# Altium schematic sheet 12V_Efuses1.SchDoc
size A4; SheetNumber: 3; SheetTotal: 5
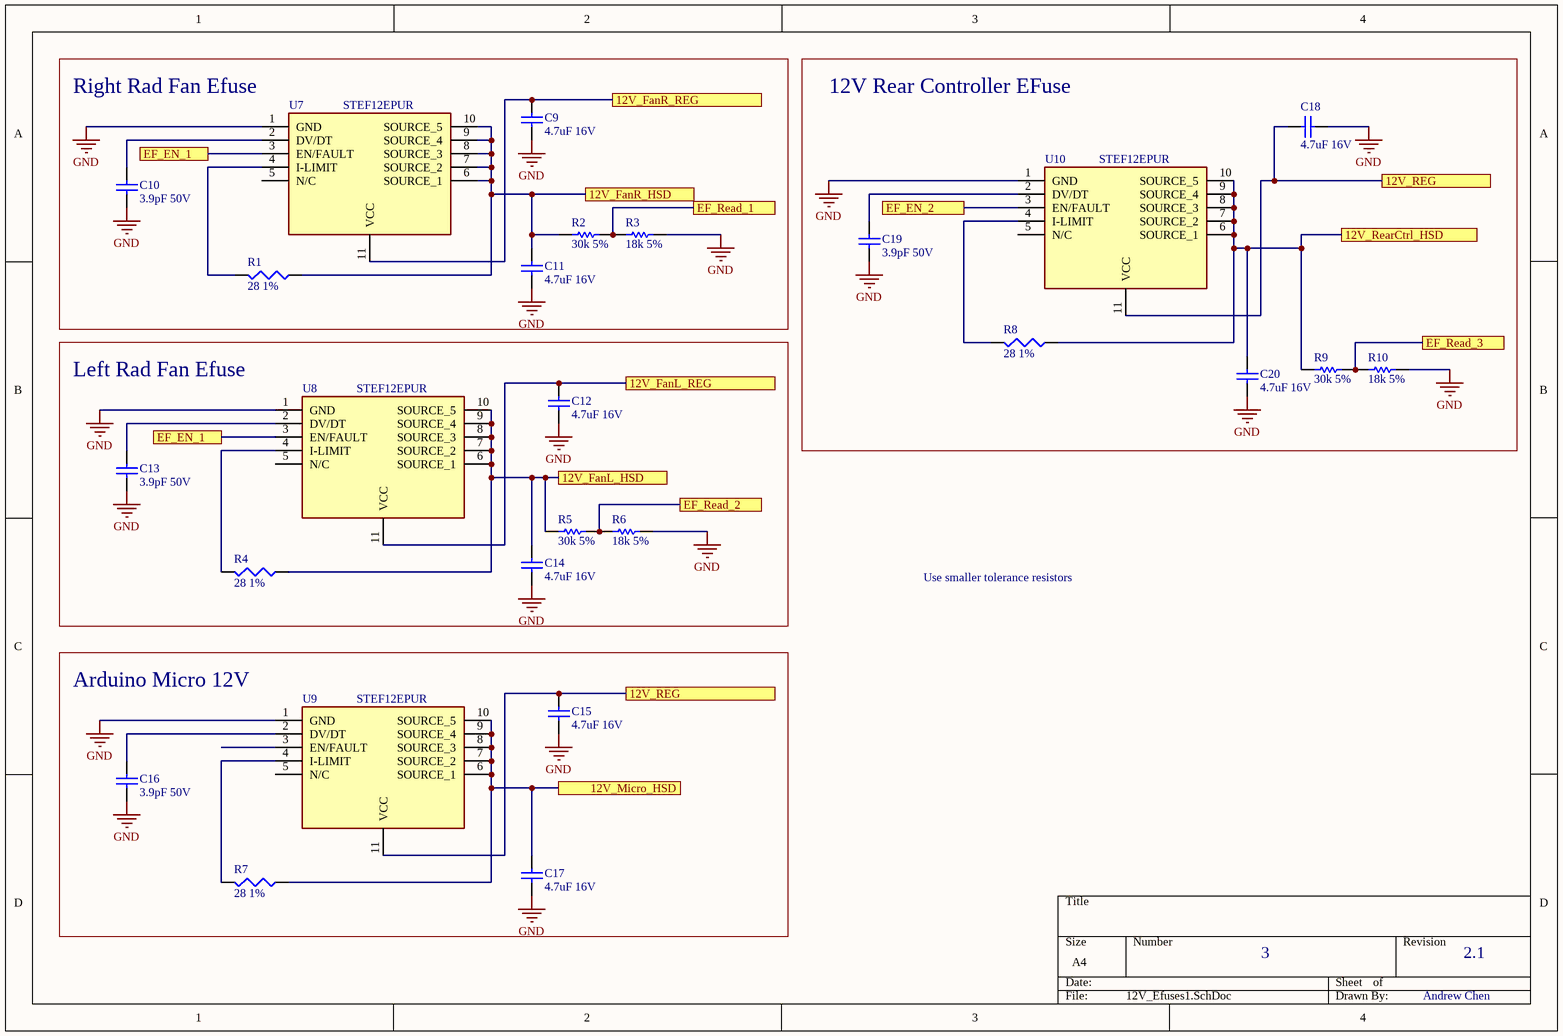
[diagram p0: 12V_Efuses1.SchDoc]

## Parts
C9  4.7uF 16V  [C1206]
C10  3.9pF 50V  [C1206]
C11  4.7uF 16V  [C1206]
C12  4.7uF 16V  [C1206]
C13  3.9pF 50V  [C1206]
C14  4.7uF 16V  [C1206]
C15  4.7uF 16V  [C1206]
C16  3.9pF 50V  [C1206]
C17  4.7uF 16V  [C1206]
C18  4.7uF 16V  [C1206]
C19  3.9pF 50V  [C1206]
C20  4.7uF 16V  [C1206]
R1  28 1%  [J1-0603]
R2  30k 5%  [RESC1609X50X30NL8T20]
R3  18k 5%  [RESC1609X50X30NL8T20]
R4  28 1%  [J1-0603]
R5  30k 5%  [RESC1609X50X30NL8T20]
R6  18k 5%  [RESC1609X50X30NL8T20]
R7  28 1%  [J1-0603]
R8  28 1%  [J1-0603]
R9  30k 5%  [RESC1609X50X30NL8T20]
R10  18k 5%  [RESC1609X50X30NL8T20]
U7  STEF12EPUR  [SON50P300X300X100-11N-D]
U8  STEF12EPUR  [SON50P300X300X100-11N-D]
U9  STEF12EPUR  [SON50P300X300X100-11N-D]
U10  STEF12EPUR  [SON50P300X300X100-11N-D]

## Blocks framed on the sheet
Right Rad Fan Efuse: C9-C11 R1-R3 U7
12V Rear Controller EFuse: C18-C20 R8-R10 U10
Left Rad Fan Efuse: C12-C14 R4-R6 U8
Arduino Micro 12V: C15-C17 R7 U9

## Ports
12V_FanL_HSD, 12V_FanL_REG, 12V_FanR_HSD, 12V_FanR_REG, 12V_Micro_HSD, 12V_RearCtrl_HSD, 12V_REG, EF_EN_1, EF_EN_2, EF_Read_1, EF_Read_2, EF_Read_3

## Nets
GND: C9.2 C10.2 C11.2 C12.2 C13.2 C14.2 C15.2 C16.2 C17.2 C18.1 C19.2 C20.2 R3.2 R6.2 R10.2 U7.1(GND) U8.1(GND) U9.1(GND) U10.1(GND)
12V_FanL_HSD: C14.1 R4.1 R5.1 U8.6(SOURCE_1) U8.7(SOURCE_2) U8.8(SOURCE_3) U8.9(SOURCE_4) U8.10(SOURCE_5) ; port 12V_FanL_HSD
12V_FanL_REG: C12.1 U8.11(VCC) ; port 12V_FanL_REG
12V_FanR_HSD: C11.1 R1.1 R2.1 U7.6(SOURCE_1) U7.7(SOURCE_2) U7.8(SOURCE_3) U7.9(SOURCE_4) U7.10(SOURCE_5) ; port 12V_FanR_HSD
12V_FanR_REG: C9.1 U7.11(VCC) ; port 12V_FanR_REG
12V_Micro_HSD: C17.1 R7.1 U9.6(SOURCE_1) U9.7(SOURCE_2) U9.8(SOURCE_3) U9.9(SOURCE_4) U9.10(SOURCE_5) ; port 12V_Micro_HSD
12V_RearCtrl_HSD: C20.1 R8.1 R9.1 U10.6(SOURCE_1) U10.7(SOURCE_2) U10.8(SOURCE_3) U10.9(SOURCE_4) U10.10(SOURCE_5) ; port 12V_RearCtrl_HSD
12V_REG: C15.1 C18.2 U9.11(VCC) U10.11(VCC) ; port 12V_REG
EF_EN_1: U7.3(EN/FAULT) U8.3(EN/FAULT) ; port EF_EN_1
EF_EN_2: U10.3(EN/FAULT) ; port EF_EN_2
EF_Read_1: R2.2 R3.1 ; port EF_Read_1
EF_Read_2: R5.2 R6.1 ; port EF_Read_2
EF_Read_3: R9.2 R10.1 ; port EF_Read_3
NetC10_1: C10.1 U7.2(DV/DT)
NetC13_1: C13.1 U8.2(DV/DT)
NetC16_1: C16.1 U9.2(DV/DT)
NetC19_1: C19.1 U10.2(DV/DT)
NetR1_2: R1.2 U7.4(I-LIMIT)
NetR4_2: R4.2 U8.4(I-LIMIT)
NetR7_2: R7.2 U9.4(I-LIMIT)
NetR8_2: R8.2 U10.4(I-LIMIT)

Not connected (* = marked no-connect by the designer): U7 5(N/C); U8 5(N/C); U9 3(EN/FAULT) 5(N/C); U10 5(N/C)

## Notes on the sheet
- Use smaller tolerance resistors
- 3
- 2.1
- Andrew Chen

## Library data of the parts
C9-C20 = Cap Semi: Capacitor (Semiconductor SIM Model); Value: 22pF; Published: 8-Jun-2000; LatestRevisionDate: 29-May-2009; LatestRevisionNote: IPC-7351 Footprint Added.; PackageReference: C1206; Publisher: Altium Limited; PackageDescription: Chip Capacitor
R1 R4 R7 R8 = Res3: Resistor; Value: 220; Published: 8-Jun-2000; LatestRevisionDate: 29-May-2009; LatestRevisionNote: IPC-7351 Footprint Added.; PackageReference: J1-0603; Publisher: Altium Limited; PackageDescription: Chip Resistor
R2 R3 R5 R6 R9 R10 = CMP-2000-03816-5: CRCW06030000Z0EA; Manufacturer: Vishay Semiconductor; Voltage Rating: 75 V; Package Quantity: 5000; DatasheetVersion: 06/2012; Min Operating Temperature: -55 degC; ComponentLink1URL: http://www.vishay.com/; Mounting Technology: Surface Mount; Height: 0.45 mm; ComponentLink1Description: Manufacturer URL; REACH SVHC: Unknown; PackageReference: 0603; Packaging: Tape and Reel; Max Operating Temperature: 155 degC; Mount: Surface Mount; ComponentLink2Description: Datasheet; PackageDescription: 2-Pin Surface Mount Device, Body 1.575 x 0.85 mm; Length: 1.55 mm; ComponentLink2URL: http://www.vishay.com/docs/20035/dcrcwe3.pdf; Pins: 2; RoHSCompliant: true
U7-U10 = STEF12EPUR: Integrated Circuit; Manufacturer_Name: STMicroelectronics; Datasheet Link: https://www.arrow.com/en/products/stef12epur/stmicroelectronics; Height: 1mm; Manufacturer_Part_Number: STEF12EPUR; Mouser Part Number: 511-STEF12EPUR; Mouser Price/Stock: https://www.mouser.co.uk/ProductDetail/STMicroelectronics/STEF12EPUR?qs=mKNKSX85ZJfL9n%252BG1BPmuw%3D%3D; Arrow Part Number: STEF12EPUR; Arrow Price/Stock: https://www.arrow.com/en/products/stef12epur/stmicroelectronics